# Altium schematic sheet SIMULATION.SchDoc
size 420 x 297 mm; SheetNumber: 8; SheetTotal: 8
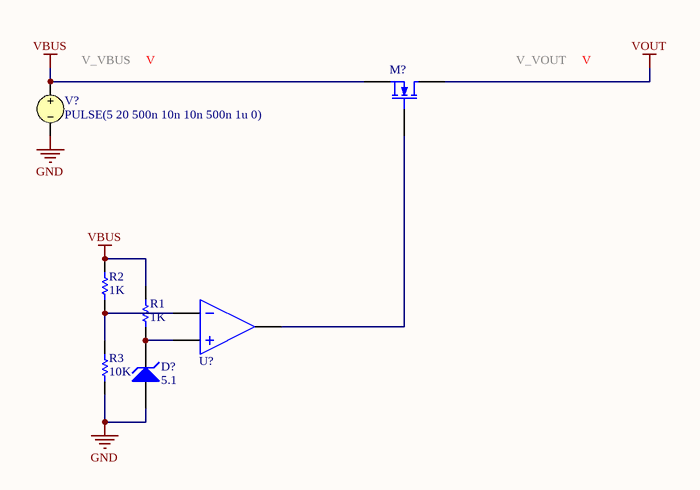
[diagram p0: SIMULATION.SchDoc]

## Parts
?  (no value)  (graphical)
D?  BV: 5.1  (hidden comment: Zener Diode)
M?  N-chanel Power MOSFET VDMOS Model  (value not drawn)
R1  value 1K  (hidden comment: Resistor)
R2  value 1K  (hidden comment: Resistor)
R3  value 10K  (hidden comment: Resistor)
U?  Ideal Comparator  (value not drawn)
V?  PULSE(5 20 500n 10n 10n 500n 1u 0)

## Nets
GND: D?.1(A) R3.1 V?.2
VBUS: M?.3(S) R1.2 R2.2 V?.1
VOUT: M?.1(D)
NetD?_2: D?.2(K) R1.1 U?.2(IN+)
NetM?_2: M?.2(G) U?.3(OUT)
NetR2_1: R2.1 R3.2 U?.1(IN-)

## Notes on the sheet
- Title:
- Project:
- Size:
- Date:
- File:
- A3
- Time:
- Drawn By:
- Sheet:
- Revision:
- Of

## Library data of the parts
? = Title_Block
D? = Zener Diode: AF: 1; BV_MAX: 1e99; CJO: 0; EG: 1.11; FC: 0.5; IBV: 0.001; IS: 1e-14; MJSW: 0.33; NTUN: 30; TNOM: 27; XTI: 3; SimulationGenericComponent: True; CJP: 0; CTA: 0; CTP: 0; FCS: 0.5; FV_MAX: 1e99; IKF: 0; IKR: 0; ISR: 1e-14; JSW: 0; JTUN: 0; JTUNSW: 0; KEG: 1; KF: 0; LEVEL: 1; N: 1; NBV: 1; NR: 1; NS: 1; PHP: 1; RS: 0; TCV: 0; TLEV: 0; TLEVC: 0; TM1: 0; TM2: 0; TPB: 0; TPHP: 0; TRS: 0; TRS2: 0; TT: 0; TTT1: 0; TTT2: 0; VJ: 1; XTITUN: 3
M? = MOSFET P-ch VDMOS: Initial D-S Voltage: 30; Initial G-S Voltage: 20; XTI: 0; A: 1; BV: 1e30; EG: 1.11; FC: 0.5; IBV: 1e-10; IS: 1e-14; PHI: 0.6; TNOM: 27; VJ: 0.8; SimulationGenericComponent: True; CGDMAX: 0; CGDMIN: 0; CGS: 0; CJO: 0; KP: 1; KSUBTHRES: 0; LAMBDA: 0; M: 0.5; MTRIODE: 1; N: 1; NBV: 1; NCHAN: 1; PCHAN: 1; RB: 0; RD: 0; RDS: 1e30; RG: 0; RQ: 0; RS: 0; SUBSHIFT: 0; SUBSLOPE: 0; THETA: 0; TT: 0; VQ: 0; VTO: 0
R1-R3 = Resistor: TC1: 0; SimulationGenericComponent: True; TC2: 0
U? = Comparator: VHIGH: 20; VLOW: 0; SimulationGenericComponent: True; VHYS: 0
V? = VSRC: Voltage Source; Note: PCB Footprint - Not required; AC Magnitude: 1; AC Phase: 0; Initial Value: 5; Pulsed Value: 20; Published: 8-Jun-2000; LatestRevisionDate: 17-Jul-2002; LatestRevisionNote: Re-released for DXP Platform.; PackageReference: Not Applicable; Publisher: Altium Limited; DC Magnitude: 0; Time Delay: 500n; Rise Time: 10n; Fall Time: 10n; Pulse Width: 500n; Period: 1u; Phase: 0